# EAGLE design front panel (EAGLE 6.5.0)
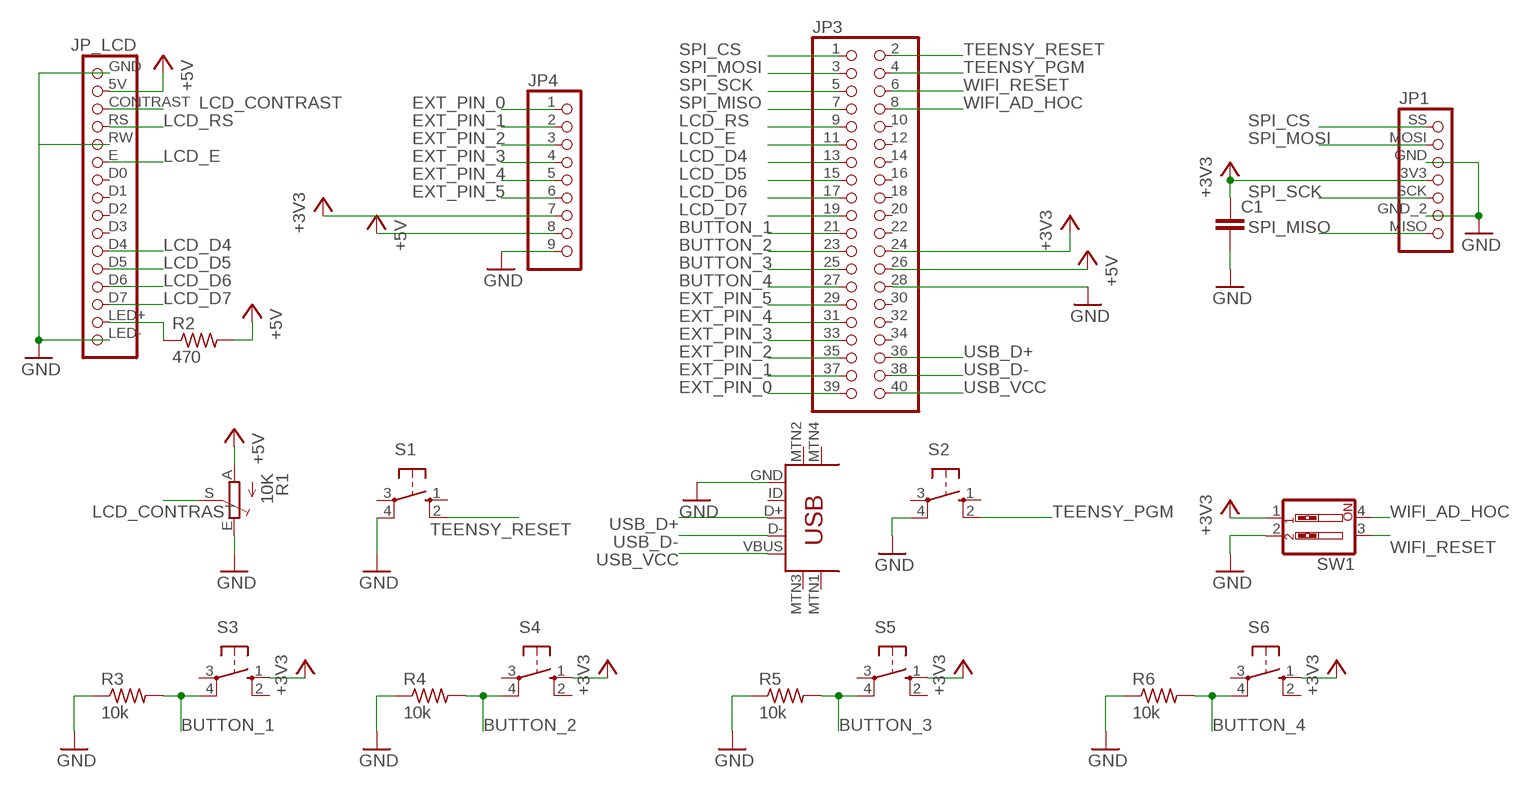
[diagram p0: schematic, sheet 1]

## Parts
C1  0.1UF-50V-20%(PTH)KIT-EZ  [CAP-PTH-SMALL-KIT]
JP1  PINHD-1X7  [1X07]
JP3  PINHD-2X20  [2X20]
JP4  PINHD-1X9  [1X09]
JP_LCD  PINHD-1X16  [1X16]
R1  10K  TRIM_EU-CA6V  [CA6V]
R2  470  R-US_0207/10  [0207/10]
R3  10k  R-US_0207/10  [0207/10]
R4  10k  R-US_0207/10  [0207/10]
R5  10k  R-US_0207/10  [0207/10]
R6  10k  R-US_0207/10  [0207/10]
S1  10-XX  [B3F-10XX]
S2  10-XX  [B3F-10XX]
S3  10-XX  [B3F-10XX]
S4  10-XX  [B3F-10XX]
S5  10-XX  [B3F-10XX]
S6  10-XX  [B3F-10XX]
SW1  SW_DIP-2  [EDG-02]
U$1  USB-MINIB-5PIN  [USB-MINIB]

## Nets
+3V3: C1.1 JP1.3V3 JP3.24 JP4.7 S3.1(S) S4.1(S) S5.1(S) S6.1(S) SW1.1
+5V: JP3.26 JP4.8 JP_LCD.5V R1.A R2.2
BUTTON_1: JP3.21 R3.2 S3.4(P1)
BUTTON_2: JP3.23 R4.2 S4.4(P1)
BUTTON_3: JP3.25 R5.2 S5.4(P1)
BUTTON_4: JP3.27 R6.2 S6.4(P1)
EXT_PIN_0: JP3.39 JP4.1
EXT_PIN_1: JP3.37 JP4.2
EXT_PIN_2: JP3.35 JP4.3
EXT_PIN_3: JP3.33 JP4.4
EXT_PIN_4: JP3.31 JP4.5
EXT_PIN_5: JP3.29 JP4.6
GND: C1.2 JP1.GND JP1.GND_2 JP3.28 JP4.9 JP_LCD.GND JP_LCD.LED- JP_LCD.RW R1.E R3.1 R4.1 R5.1 R6.1 S1.4(P1) S2.4(P1) SW1.2 U$1.GND
LCD_CONTRAST: JP_LCD.CONTRAST R1.S
LCD_D4: JP3.13 JP_LCD.D4
LCD_D5: JP3.15 JP_LCD.D5
LCD_D6: JP3.17 JP_LCD.D6
LCD_D7: JP3.19 JP_LCD.D7
LCD_E: JP3.11 JP_LCD.E
LCD_RS: JP3.9 JP_LCD.RS
N$1: JP_LCD.LED+ R2.1
SPI_CS: JP1.SS JP3.1
SPI_MISO: JP1.MISO JP3.7
SPI_MOSI: JP1.MOSI JP3.3
SPI_SCK: JP1.SCK JP3.5
TEENSY_PGM: JP3.4 S2.2(S1)
TEENSY_RESET: JP3.2 S1.2(S1)
USB_D+: JP3.36 U$1.D+
USB_D-: JP3.38 U$1.D-
USB_VCC: JP3.40 U$1.VBUS
WIFI_AD_HOC: JP3.8 SW1.4
WIFI_RESET: JP3.6 SW1.3
Unconnected: JP3.10 JP3.12 JP3.14 JP3.16 JP3.18 JP3.20 JP3.22 JP3.30 JP3.32 JP3.34 JP_LCD.D0 JP_LCD.D1 JP_LCD.D2 JP_LCD.D3 S1.1(S) S1.3(P) S2.1(S) S2.3(P) S3.2(S1) S3.3(P) S4.2(S1) S4.3(P) S5.2(S1) S5.3(P) S6.2(S1) S6.3(P) U$1.ID U$1.MTN1(MTN2) U$1.MTN2(MTN3) U$1.MTN3(MTN1) U$1.MTN4

## Library data of the parts
C1 = SparkFun-Capacitors:0.1UF-50V-20%(PTH): CAP-08370; PROD_ID: CAP-08370
JP1 = sd_header:PINHD-1X7: PIN HEADER
JP3 = pinhead:PINHD-2X20: PIN HEADER
JP4 = pinhead:PINHD-1X9: PIN HEADER
JP_LCD = LCD_HEADER:PINHD-1X16: PIN HEADER
R1 = pot:TRIM_EU-: POTENTIOMETER
R2-R6 = adafruit:R-US_: RESISTOR, American symbol
S1-S6 = switch-omron:10-XX: OMRON SWITCH; MPN: B3F-1000; OC_FARNELL: 176432; OC_NEWARK: 36M3542
SW1 = special:SW_DIP-2: DIP SWITCH
U$1 = SparkFun:USB-MINIB

## Net classes
0 default: width 0.203 mm

## Board
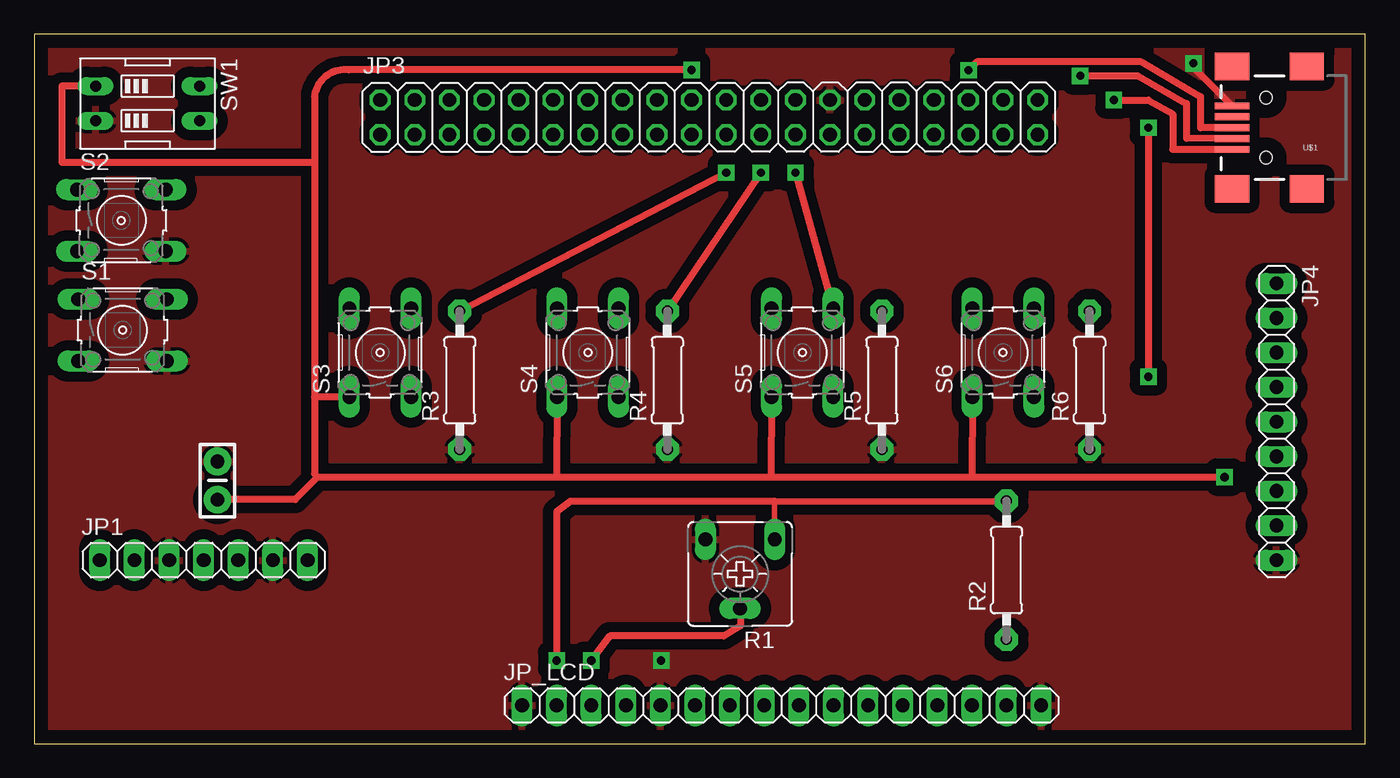
[diagram p1: board, top side]
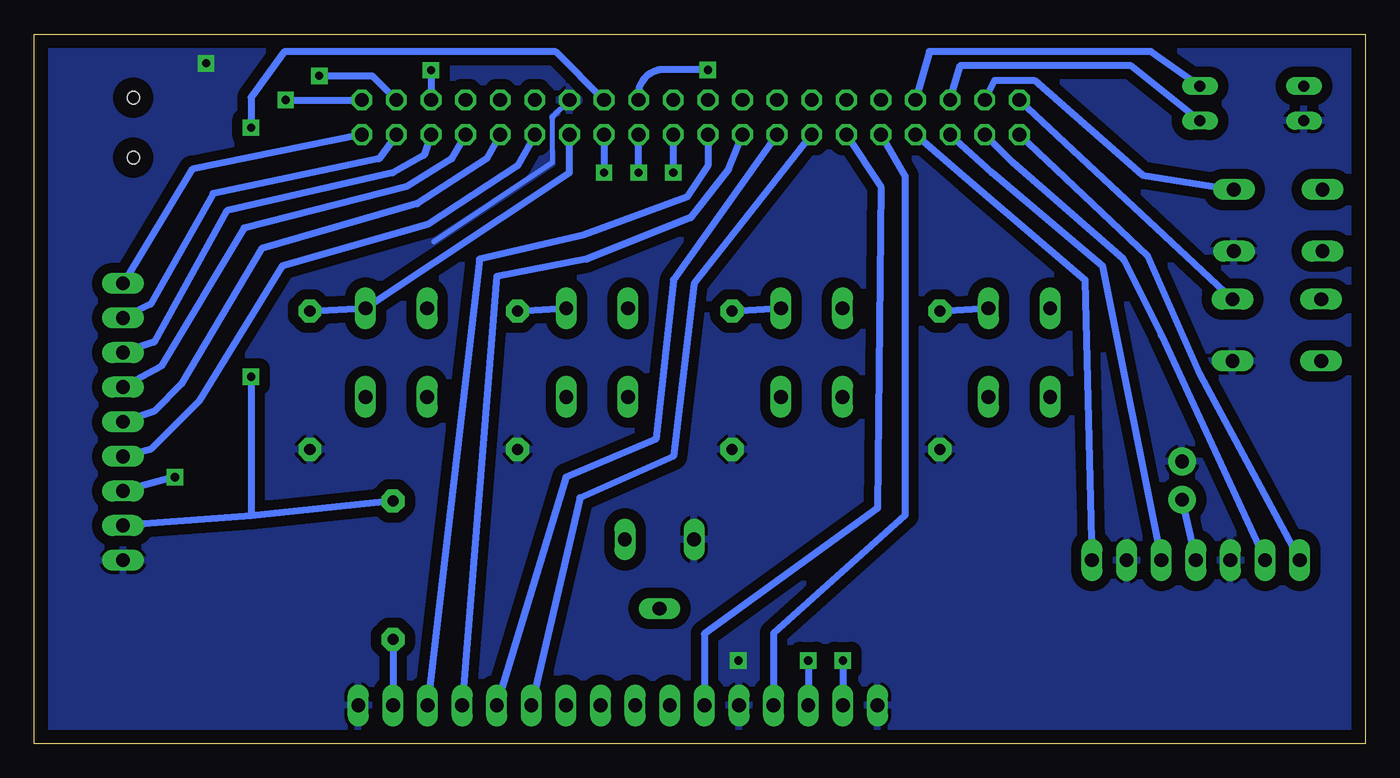
[diagram p2: board, bottom side, seen from below]

Size 97.71 x 52.09 mm. Coordinates in mm from the lower left corner, seen from the top.
Outline: 0,0 97.71,0 97.71,52.09 0,52.09 0,0
Copper layers (1*16): Top 0.035mm / dielectric 1.5mm / Bottom 0.035mm
Design rules "MWSEagleDesignRules2": minimum track width 13mil, minimum drill 22mil, track to track 13mil, track to pad 13mil, pad to pad 13mil, via to via 13mil, smd to smd 8mil, copper to edge 40mil, drill to drill 8mil, minimum pad ring 10mil, minimum via ring 8mil, stop-mask expansion 4mil, vias tented up to drill 0mil, thermal gap 10mil

### Footprints (pad centres in the part's own frame; a part is rotated, then mirrored left to right if it is on the bottom)
CAP-PTH-SMALL-KIT = drill 1.016 pad 2.032: 1 -1.397,0; 2 1.397,0
1X07 = drill 1.016 long: 3V3 0,0; GND -2.54,0; GND_2 5.08,0; MISO 7.62,0; MOSI -5.08,0; SCK 2.54,0; SS -7.62,0
2X20 = drill 1.016 octagon: 1 -24.13,-1.27; 2 -24.13,1.27; 3 -21.59,-1.27; 4 -21.59,1.27; 5 -19.05,-1.27; 6 -19.05,1.27; 7 -16.51,-1.27; 8 -16.51,1.27; 9 -13.97,-1.27; 10 -13.97,1.27; 11 -11.43,-1.27; 12 -11.43,1.27; 13 -8.89,-1.27; 14 -8.89,1.27; 15 -6.35,-1.27; 16 -6.35,1.27; 17 -3.81,-1.27; 18 -3.81,1.27; 19 -1.27,-1.27; 20 -1.27,1.27; 21 1.27,-1.27; 22 1.27,1.27; 23 3.81,-1.27; 24 3.81,1.27; 25 6.35,-1.27; 26 6.35,1.27; 27 8.89,-1.27; 28 8.89,1.27; 29 11.43,-1.27; 30 11.43,1.27; 31 13.97,-1.27; 32 13.97,1.27; 33 16.51,-1.27; 34 16.51,1.27; 35 19.05,-1.27; 36 19.05,1.27; 37 21.59,-1.27; 38 21.59,1.27; 39 24.13,-1.27; 40 24.13,1.27
1X09 = drill 1.016 long: 1 -10.16,0; 2 -7.62,0; 3 -5.08,0; 4 -2.54,0; 5 0,0; 6 2.54,0; 7 5.08,0; 8 7.62,0; 9 10.16,0
1X16 = drill 1.016 long: 5V -16.51,0; CONTRAST -13.97,0; D0 -3.81,0; D1 -1.27,0; D2 1.27,0; D3 3.81,0; D4 6.35,0; D5 8.89,0; D6 11.43,0; D7 13.97,0; E -6.35,0; GND -19.05,0; LED+ 16.51,0; LED- 19.05,0; RS -11.43,0; RW -8.89,0
CA6V = drill 1.016 long: A -2.54,-2.54; E 2.54,-2.54; S 0,2.54
0207/10 = drill 0.813 pad 1.676 octagon: 1 -5.08,0; 2 5.08,0
B3F-10XX = drill 1.016 long: 1 -3.251,2.261; 2 3.251,2.261; 3 -3.251,-2.261; 4 3.251,-2.261
EDG-02 = drill 0.813 long: 1 -1.27,-3.81; 2 1.27,-3.81; 3 1.27,3.81; 4 -1.27,3.81
USB-MINIB = smd 2.5 x 0.5: D+ 2.5,0; D- 2.5,0.8; GND 2.5,-1.6; ID 2.5,-0.8; VBUS 2.5,1.6 | smd 2.5 x 2: MTN1 -3,4.5; MTN2 2.5,4.5; MTN3 -3,-4.5; MTN4 2.5,-4.5 | hole 0.9: 0,2.2; 0,-2.2

### Placement (x,y rotation side)
C1  13.46,19.3 90 top
JP1  12.45,13.46 0 top
JP3  49.53,45.97 0 top
JP4  91.19,23.62 270 top
JP_LCD  54.86,2.79 0 top
R1  51.82,12.45 180 top
R2  71.37,12.73 90 top
R3  31.24,26.67 90 top
R4  46.48,26.67 90 top
R5  62.23,26.67 90 top
R6  77.47,26.67 90 top
S1  6.5,30.35 0 top
S2  6.4,38.4 0 top
S3  25.4,28.7 90 top
S4  40.64,28.7 90 top
S5  56.39,28.7 90 top
S6  71.12,28.7 90 top
SW1  8.33,46.99 270 top
U$1  90.42,45.21 180 top

### Tracks (layer width: path | path; a pad name or v marks a point on that pad's centre or on a via)
+3V3  (via drill 0.6)
  Top 0.406: 20.57,19.81 20.83,19.56
  Top 0.508: v48.26,49.45 23.11,49.45 arc90 20.57,47.5 20.57,42.67 | 20.57,42.67 20.57,25.45 | 20.57,25.45 20.57,19.81 | 38.35,19.56 20.83,19.56 19.18,17.91 C1.1 | 38.35,19.56 54.1,19.56 | 54.1,19.56 68.83,19.56 | 68.83,19.56 v87.38,19.56 | S4.1 38.35,19.56 | S5.1 54.1,19.56 | S6.1 68.83,19.56 | S3.1 20.57,25.45 | SW1.1 2.03,48.26 2.03,42.67 20.57,42.67
  Bottom 0.508: v48.26,49.45 51.82,49.45 arc-90 JP3.24 | v87.38,19.56 JP4.7 | C1.1 JP1.3V3
+5V  (via drill 0.6)
  Top 0.406: R1.A 54.36,17.78
  Top 0.508: R2.2 54.36,17.78 39.37,17.78 38.35,17.02 v38.35,6.1 | v81.79,45.21 v81.79,26.92
  Bottom 0.508: R2.2 81.78,16.73 | 81.78,16.73 JP4.8 91.07,16.12 89.67,16.12 | v81.79,26.92 81.79,16.73 arc-90 81.78,16.73 | v38.35,6.1 JP_LCD.5V | JP3.26 59.41,50.77 79.38,50.77 81.79,47.45 v81.79,45.21
BUTTON_1  (via drill 0.6)
  Top 0.508: R3.2 v50.8,41.91
  Bottom 0.508: R3.2 S3.4 | v50.8,41.91 JP3.21
BUTTON_2  (via drill 0.6)
  Top 0.508: v53.34,41.91 R4.2
  Bottom 0.508: R4.2 S4.4 | v53.34,41.91 JP3.23
BUTTON_3  (via drill 0.6)
  Top 0.508: v55.88,41.91 S5.4
  Bottom 0.508: R5.2 S5.4 | JP3.25 v55.88,41.91
BUTTON_4
  Bottom 0.508: R6.2 S6.4 58.42,41.91 JP3.27
EXT_PIN_0
  Bottom 0.508: JP3.39 86.11,42.16 JP4.1
EXT_PIN_1
  Bottom 0.508: JP4.2 89.15,32.26 84.58,40.39 72.39,42.93 JP3.37
EXT_PIN_2
  Bottom 0.508: JP4.3 88.9,29.46 83.57,39.12 71.37,41.91 69.09,43.18 JP3.35
EXT_PIN_3
  Bottom 0.508: JP4.4 88.39,27.69 82.3,37.85 70.36,40.89 67.06,42.93 JP3.33
EXT_PIN_4
  Bottom 0.508: JP3.31 64.52,42.93 69.6,39.62 81.03,36.32 86.87,26.42 88.9,24.38 JP4.5
EXT_PIN_5
  Bottom 0.508: JP3.29 62.23,42.42 68.83,38.1 79.5,35.05 85.6,25.15 89.15,21.59 JP4.6
GND  (via drill 0.6)
  Top 0.508: U$1.GND 85.09,49.65 v85.09,49.94
  Bottom 0.356: 59.69,46 59.69,42.65
  Bottom 0.406: JP3.28 59.69,46 | 59.69,42.65 68.35,36.85
  other vias: 46.02,6.1
  pour Top (isolate 0.762): 0.05,51.92 0,0 97.79,0 97.84,51.92
  pour Bottom (isolate 0.762): -0.3,51.74 0,0 98.04,0.25 97.74,51.99
LCD_CONTRAST  (via drill 0.6)
  Top 0.508: R1.S 51.84,8.64 50.62,7.9 42.24,7.9 v40.89,6.1
  Bottom 0.508: v40.89,6.1 JP_LCD.CONTRAST
LCD_D4
  Bottom 0.508: JP3.13 49.28,33.78 50.8,21.08 57.66,18.03 JP_LCD.D4
LCD_D5
  Bottom 0.508: JP3.15 50.8,34.04 52.07,22.35 58.67,19.56 JP_LCD.D5
LCD_D6
  Bottom 0.508: JP_LCD.D6 63.75,34.29 57.15,35.56 49.53,38.61 46.74,42.16 JP3.17
LCD_D7
  Bottom 0.508: JP_LCD.D7 65.02,35.56 57.4,37.34 49.78,40.13 48.26,42.42 JP3.19
LCD_E
  Bottom 0.508: JP3.11 35.56,40.89 35.81,17.27 48.51,8.05 JP_LCD.E
LCD_RS
  Bottom 0.508: JP3.9 33.78,41.66 33.78,16.76 43.43,8.1 JP_LCD.RS
N$1
  Bottom 0.508: R2.1 JP_LCD.LED+
SPI_CS
  Bottom 0.508: JP3.1 16,35.81 12.14,27.1 JP1.SS
SPI_MISO
  Bottom 0.508: JP3.7 29.21,41.4 20.57,34.04 JP1.MISO
SPI_MOSI
  Bottom 0.508: JP3.3 25.91,42.67 17.78,35.56 14.99,29.97 JP1.MOSI
SPI_SCK
  Bottom 0.508: JP3.5 27.43,41.91 19.3,35.05 JP1.SCK
TEENSY_PGM
  Bottom 0.508: JP3.4 27.2,48.69 24.31,48.69 16.36,41.73 S2.2
TEENSY_RESET
  Bottom 0.508: JP3.2 S1.2
USB_D+  (via drill 0.6)
  Top 0.508: U$1.D+ 85.6,45.21 85.6,47.5 81.28,50.04 69.19,50.04 v68.58,49.43
  Bottom 0.508: v68.58,49.43 JP3.36
USB_D-  (via drill 0.6)
  Top 0.508: v76.78,49.02 81.03,49.02 84.58,46.99 84.58,44.42 U$1.D-
  Bottom 0.508: v76.78,49.02 72.9,49.02 JP3.38
USB_VCC  (via drill 0.6)
  Top 0.508: v79.25,47.24 81.79,47.24 83.57,46.23 83.57,43.61 U$1.VBUS
  Bottom 0.508: v79.25,47.24 JP3.40
WIFI_AD_HOC
  Bottom 0.508: SW1.4 15.75,50.8 32,50.8 JP3.8
WIFI_RESET
  Bottom 0.508: JP3.6 29.72,49.78 17.27,49.78 SW1.3